# EAGLE design Auto_hub_robocon (EAGLE 8.4.3)
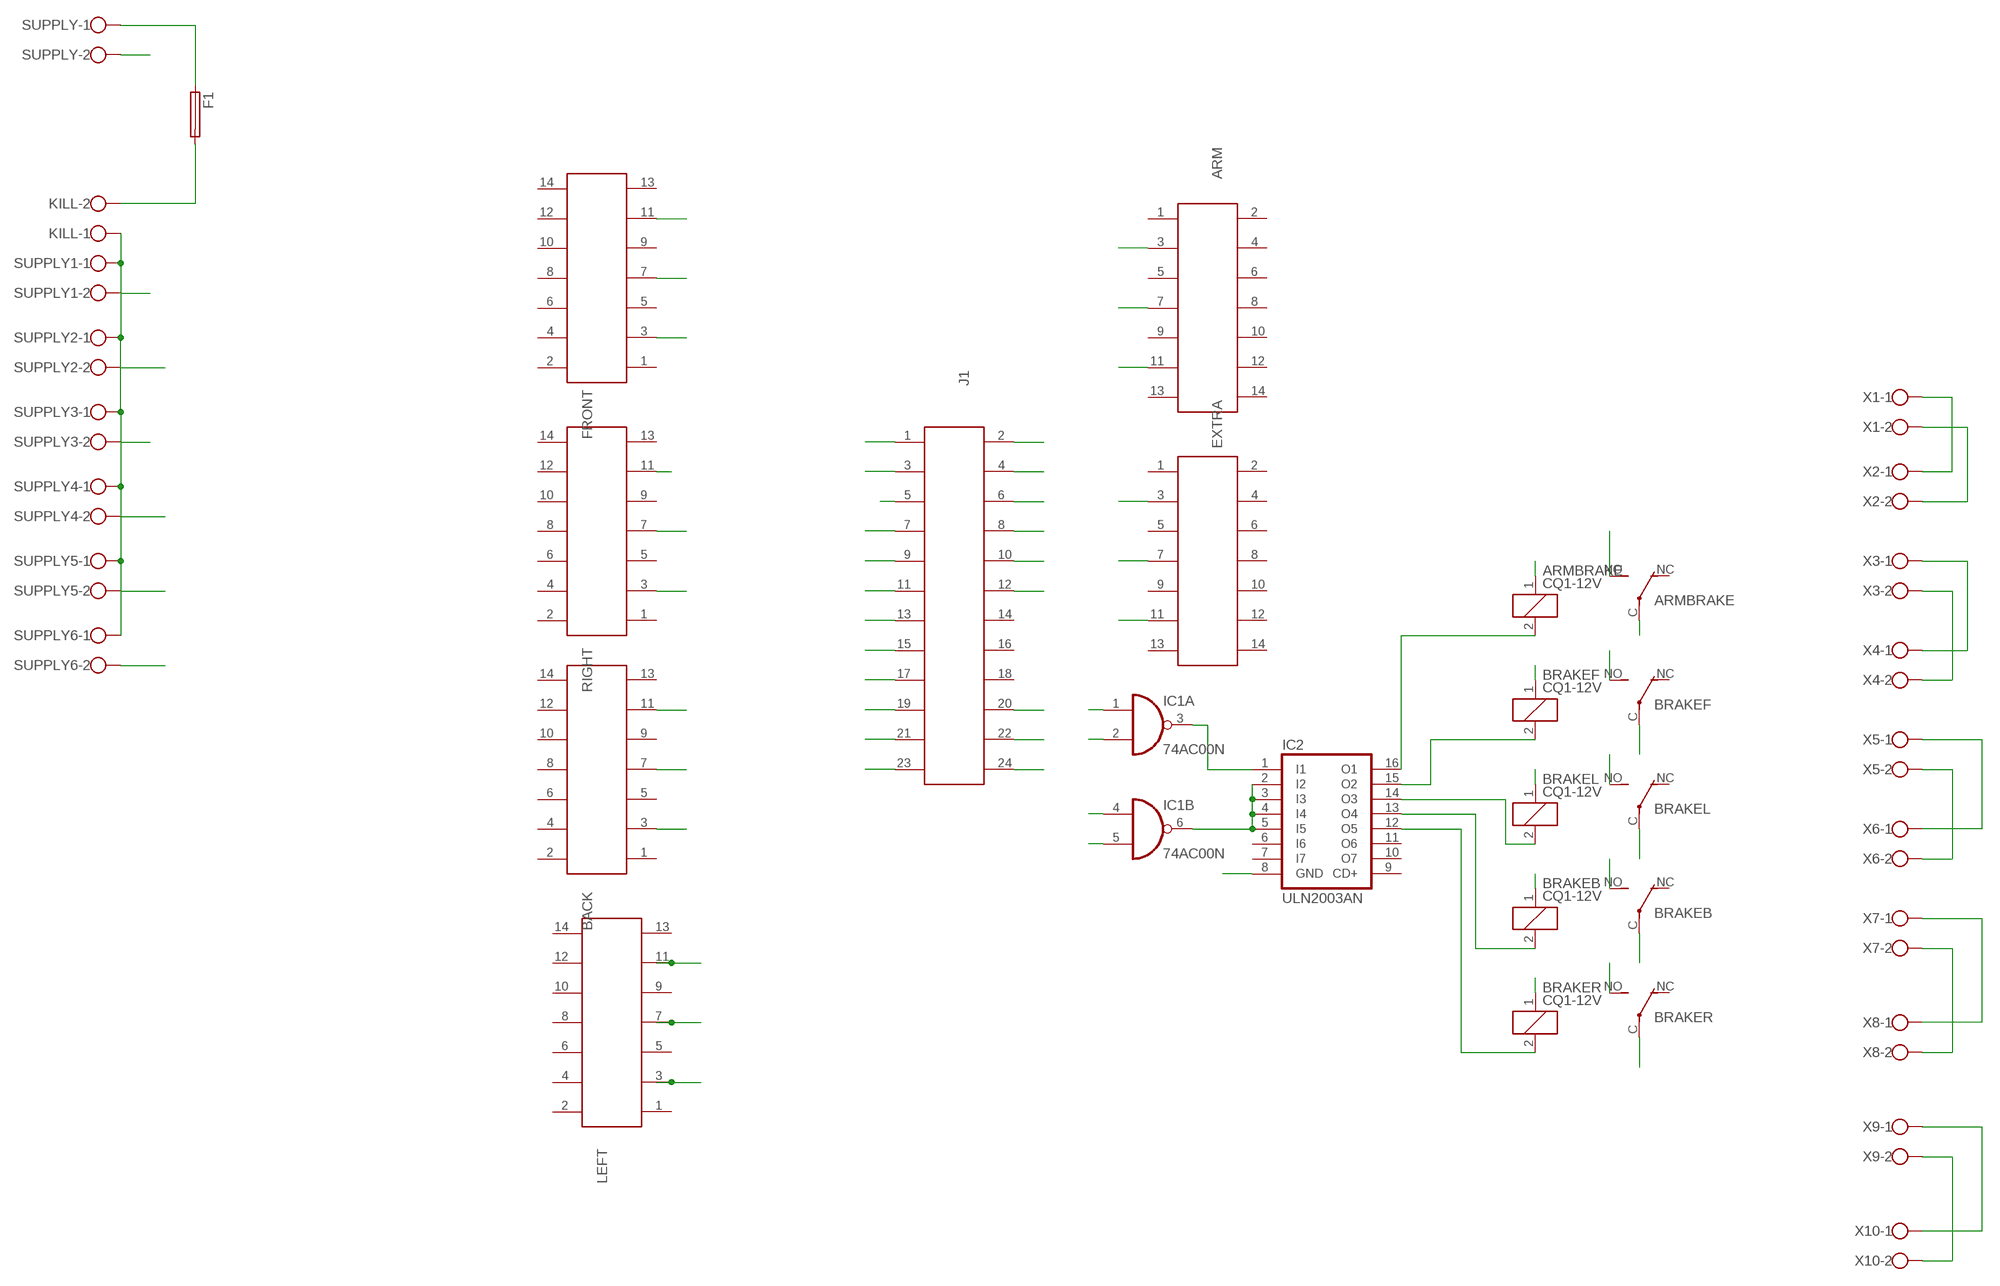
[diagram p0: schematic, sheet 1]

## Parts
ARM  61201421621  [61201421621]
ARMBRAKE  CQ1-12V  [CQ1]
BACK  61201421621  [61201421621]
BRAKEB  CQ1-12V  [CQ1]
BRAKEF  CQ1-12V  [CQ1]
BRAKEL  CQ1-12V  [CQ1]
BRAKER  CQ1-12V  [CQ1]
EXTRA  61201421621  [61201421621]
F1  GSH15  [GSH15]
FRONT  61201421621  [61201421621]
IC1  74AC00N  [DIL14]
IC2  ULN2003AN  [DIL16]
J1  61202421621  [61202421621]
KILL  W237-102  [W237-102]
LEFT  61201421621  [61201421621]
RIGHT  61201421621  [61201421621]
SUPPLY  W237-102  [W237-102]
SUPPLY1  W237-102  [W237-102]
SUPPLY2  W237-102  [W237-102]
SUPPLY3  W237-102  [W237-102]
SUPPLY4  W237-102  [W237-102]
SUPPLY5  W237-102  [W237-102]
SUPPLY6  W237-102  [W237-102]
X1  W237-102  [W237-102]
X2  W237-102  [W237-102]
X3  W237-102  [W237-102]
X4  W237-102  [W237-102]
X5  W237-102  [W237-102]
X6  W237-102  [W237-102]
X7  W237-102  [W237-102]
X8  W237-102  [W237-102]
X9  W237-102  [W237-102]
X10  W237-102  [W237-102]

## Nets
5V: ARMBRAKE.1 BRAKEB.1 BRAKEF.1 BRAKEL.1 BRAKER.1 IC1.2(A:I1) IC1.4(B:I0) J1.22
ARM1: ARMBRAKE.C(2:P) X1.1 X2.1
ARM2: ARMBRAKE.NO(2:S) X1.2 X2.2
ARMBRAKE: IC1.1(A:I0) J1.20
ARMIN1: ARM.3 J1.2
ARMIN2: ARM.11 J1.6
ARMPWM: ARM.7 J1.4
BASEBRAKE: IC1.5(B:I1) J1.24
BIN1: BACK.11 J1.13
BIN2: BACK.3 J1.17
BPWM: BACK.7 J1.15
BRAKEB1: BRAKEB.C(2:P) X7.1 X8.1
BRAKEB2: BRAKEB.NO(2:S) X7.2 X8.2
BRAKEF1: BRAKEF.C(2:P) X3.1 X4.1
BRAKEF2: BRAKEF.NO(2:S) X3.2 X4.2
BRAKEL1: BRAKEL.C(2:P) X5.1 X6.1
BRAKEL2: BRAKEL.NO(2:S) X5.2 X6.2
BRAKER1: BRAKER.C(2:P) X9.1 X10.1
BRAKER2: BRAKER.NO(2:S) X9.2 X10.2
EXTRAIN1: EXTRA.3 J1.8
EXTRAIN2: EXTRA.11 J1.12
EXTRAPWM: EXTRA.7 J1.10
FIN1: FRONT.11 J1.1
FIN2: FRONT.3 J1.5
FPWM: FRONT.7 J1.3
GND: IC2.8(GND) SUPPLY1.2 SUPPLY2.2 SUPPLY3.2 SUPPLY4.2 SUPPLY5.2 SUPPLY6.2 SUPPLY.2
LIN1: J1.19 LEFT.11
LIN2: J1.23 LEFT.3
LPWM: J1.21 LEFT.7
N$1: ARMBRAKE.2 IC2.16(O1)
N$2: BRAKEF.2 IC2.15(O2)
N$3: BRAKEL.2 IC2.14(O3)
N$4: IC1.3(A:O) IC2.1(I1)
N$5: BRAKEB.2 IC2.13(O4)
N$6: BRAKER.2 IC2.12(O5)
N$7: IC1.6(B:O) IC2.2(I2) IC2.3(I3) IC2.4(I4) IC2.5(I5)
N$8: F1.1 SUPPLY.1
N$9: F1.2 KILL.2
N$10: KILL.1 SUPPLY1.1 SUPPLY2.1 SUPPLY3.1 SUPPLY4.1 SUPPLY5.1 SUPPLY6.1
RIN1: J1.7 RIGHT.11
RIN2: J1.11 RIGHT.3
RPWM: J1.9 RIGHT.7
Unconnected: ARM.1 ARM.2 ARM.4 ARM.5 ARM.6 ARM.8 ARM.9 ARM.10 ARM.12 ARM.13 ARM.14 ARMBRAKE.NC(2:O) BACK.1 BACK.2 BACK.4 BACK.5 BACK.6 BACK.8 BACK.9 BACK.10 BACK.12 BACK.13 BACK.14 BRAKEB.NC(2:O) BRAKEF.NC(2:O) BRAKEL.NC(2:O) BRAKER.NC(2:O) EXTRA.1 EXTRA.2 EXTRA.4 EXTRA.5 EXTRA.6 EXTRA.8 EXTRA.9 EXTRA.10 EXTRA.12 EXTRA.13 EXTRA.14 FRONT.1 FRONT.2 FRONT.4 FRONT.5 FRONT.6 FRONT.8 FRONT.9 FRONT.10 FRONT.12 FRONT.13 FRONT.14 IC1.8(C:O) IC1.9(C:I0) IC1.10(C:I1) IC1.11(D:O) IC1.12(D:I0) IC1.13(D:I1) IC2.6(I6) IC2.7(I7) IC2.9(CD+) IC2.10(O7) IC2.11(O6) J1.14 J1.16 J1.18 LEFT.1 LEFT.2 LEFT.4 LEFT.5 LEFT.6 LEFT.8 LEFT.9 LEFT.10 LEFT.12 LEFT.13 LEFT.14 RIGHT.1 RIGHT.2 RIGHT.4 RIGHT.5 RIGHT.6 RIGHT.8 RIGHT.9 RIGHT.10 RIGHT.12 RIGHT.13 RIGHT.14

## Power pins joined to a net without a drawn wire
GND: IC1.7(P:GND)
VCC: IC1.14(P:VCC)

## Library data of the parts
ARM BACK EXTRA FRONT LEFT RIGHT = Wurth_Elektronik_Electromechanic_Wire_to_Board_Connectors_rev17b:61201421621: WR-BHD 2.54mm Male Box Header, 14 Pins=>Code : Con_WTB_BHD_2.54_Male_THT_WS_61201421621 <http://katalog.we-online.de/media/thumbs2/eican/thb_Con_WTB_BHD_2.54_Male_THT_WS_6120xx21621_pf2.jpg> Details see: http://katalog.we-online.de/en/em/612_0xx_216_21 Created 2014-06-04, Karrer Zheng 2014 (C) Würth Elektronik
ARMBRAKE BRAKEB BRAKEF BRAKEL BRAKER = relay:CQ1-12V: AUTOMOTIVE QUIET RELAY NAiS Source: http://www.mew-europe.com/.. en_ds_61208_0000.pdf; OC_FARNELL: unknown; OC_NEWARK: unknown
F1 = fuse:GSH15: FUSE HOLDER grid 15mm, 19649 Wickmann; MPN: 64900001039; OC_FARNELL: 1271673; OC_NEWARK: 02P0318
IC1 = 74xx-eu:74*00: Quad 2-input NAND gate
IC2 = uln-udn:ULN2003A: DRIVER ARRAY
J1 = Wurth_Elektronik_Electromechanic_Wire_to_Board_Connectors_rev17b:61202421621: WR-BHD 2.54mm Male Box Header, 24 Pins=>Code : Con_WTB_BHD_2.54_Male_THT_WS_61202421621 <http://katalog.we-online.de/media/thumbs2/eican/thb_Con_WTB_BHD_2.54_Male_THT_WS_6120xx21621_pf2.jpg> Details see: http://katalog.we-online.de/en/em/612_0xx_216_21 Created 2014-06-04, Karrer Zheng 2014 (C) Würth Elektronik
KILL SUPPLY SUPPLY1-SUPPLY6 X1-X10 = con-wago-500:W237-102: WAGO SCREW CLAMP; MPN: 237-102; OC_FARNELL: unknown; OC_NEWARK: 70K9898

## Board
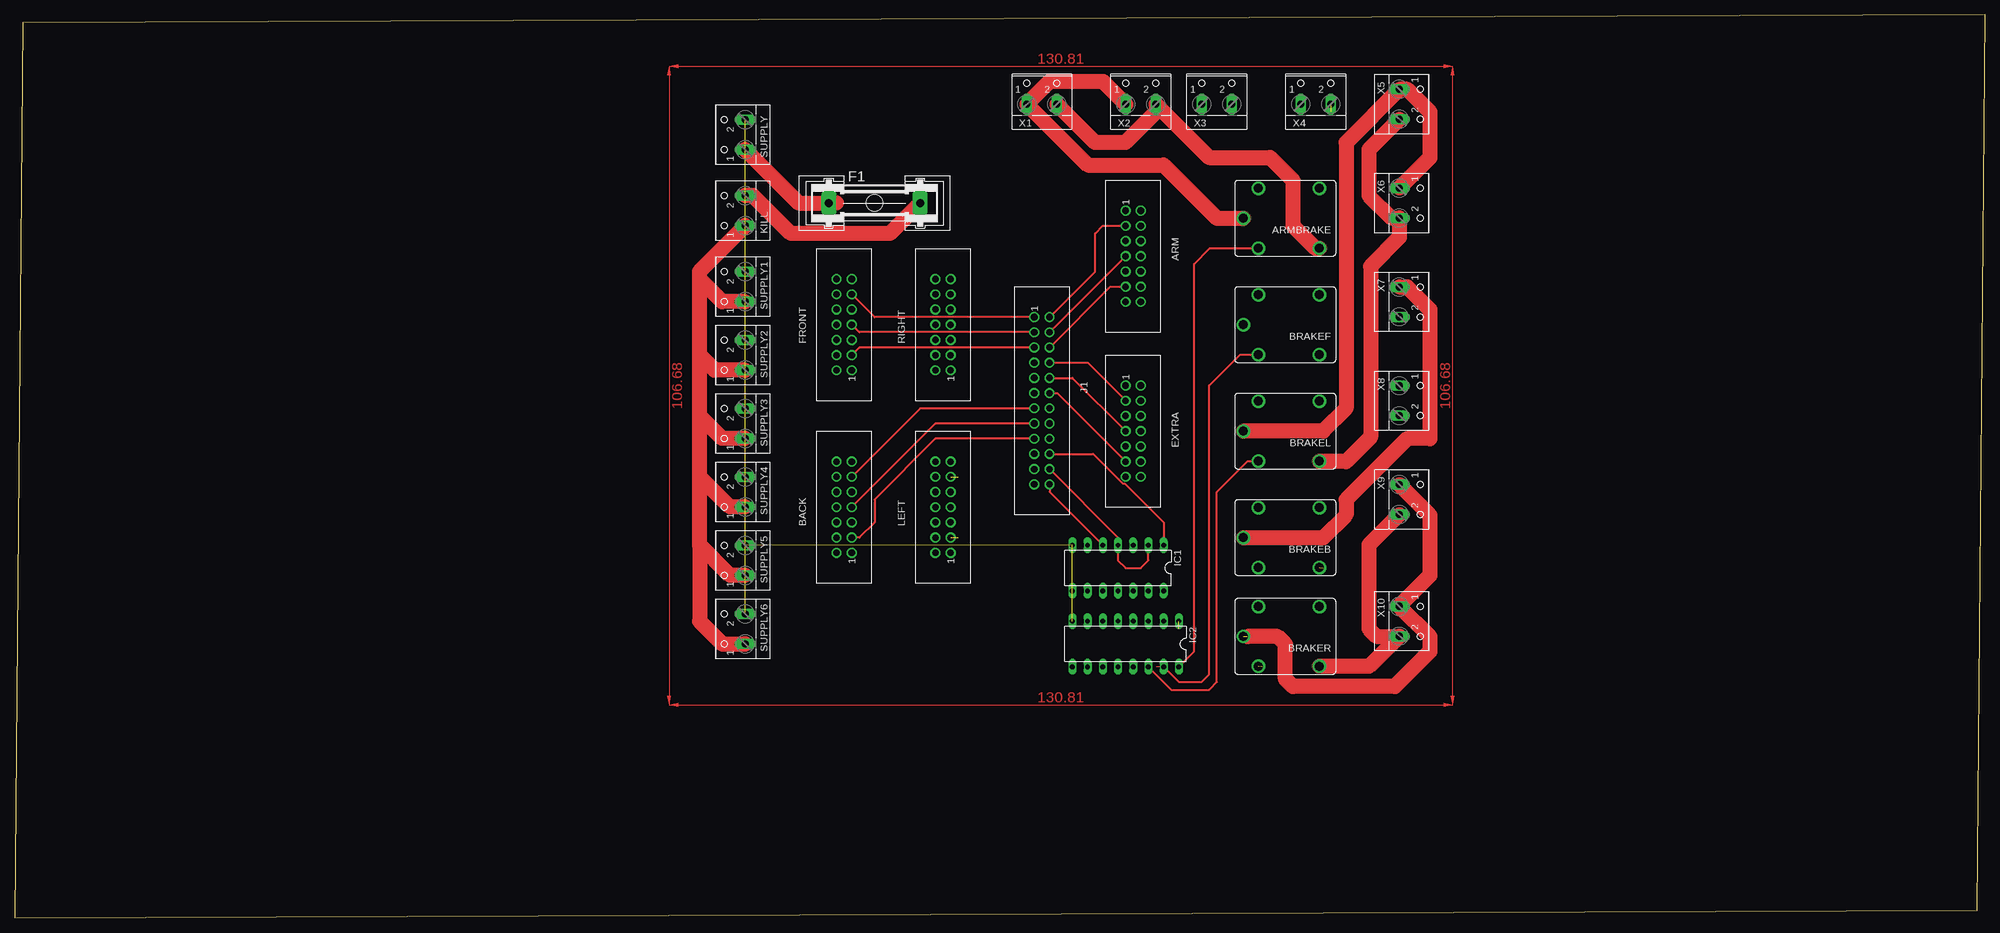
[diagram p1: board, top side]
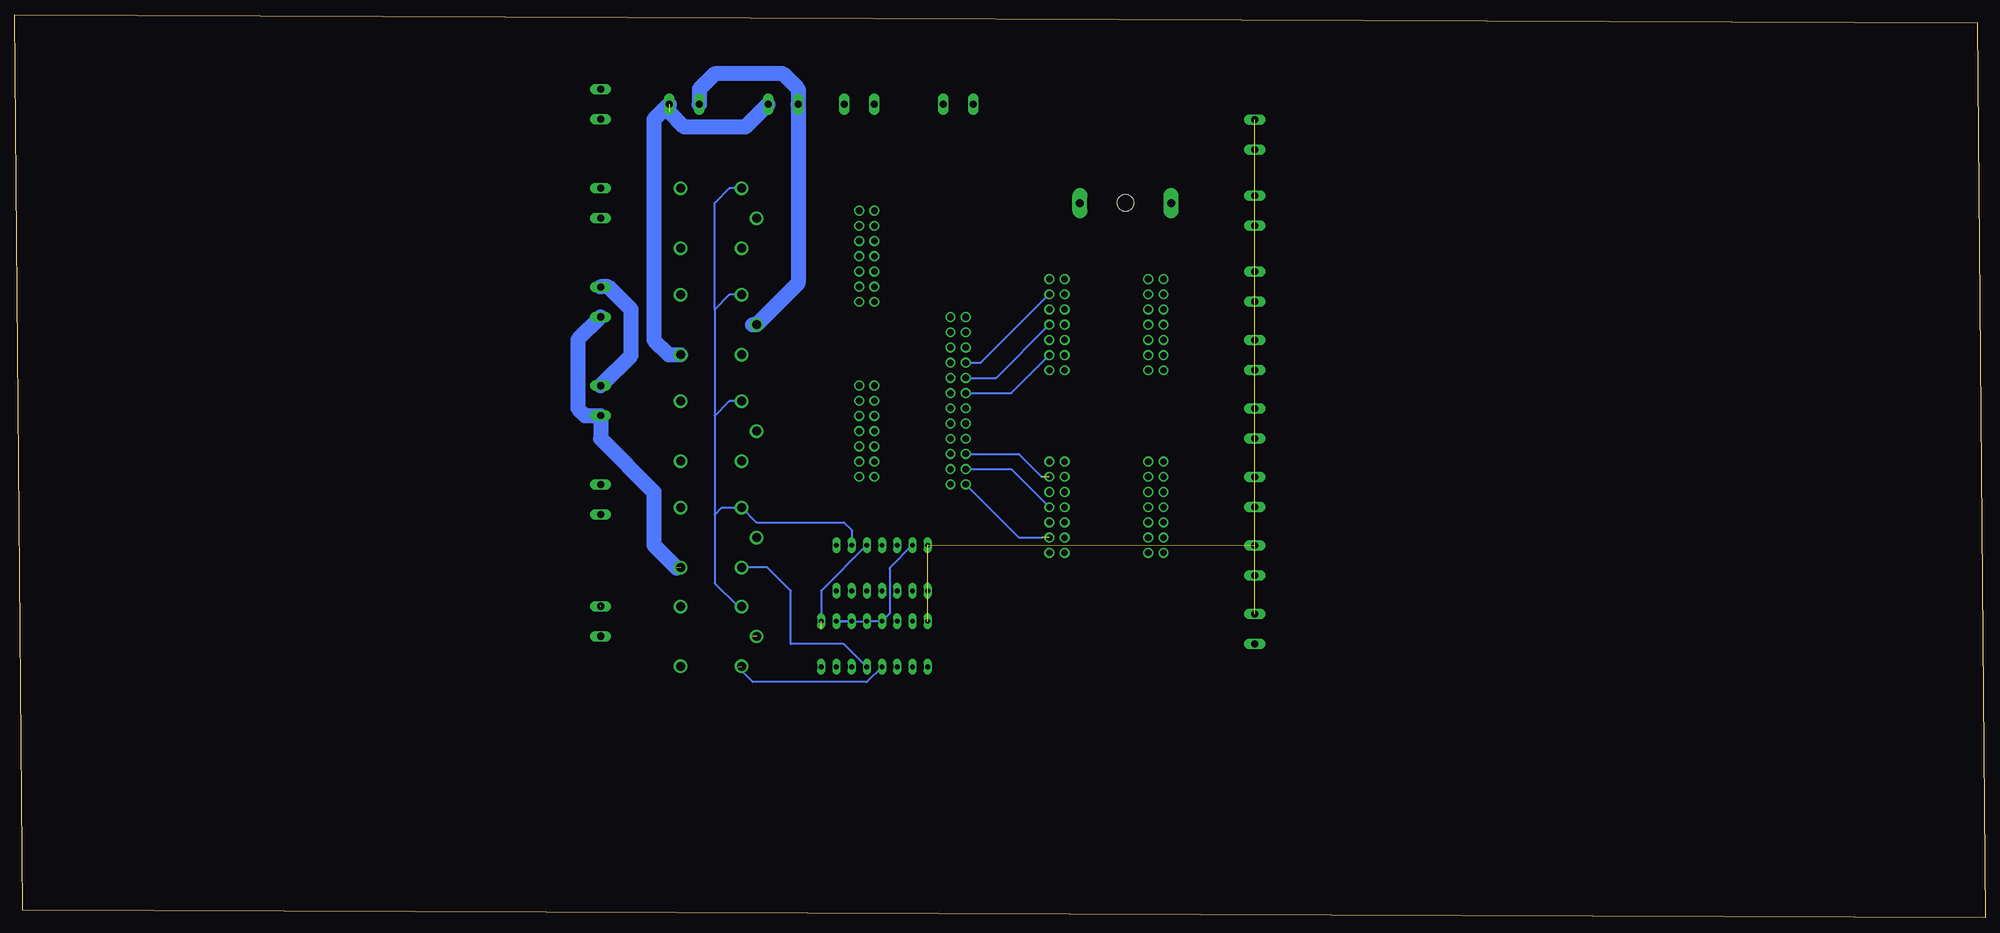
[diagram p2: board, bottom side, seen from below]

Size 328.91 x 150.8 mm. Coordinates in mm from the lower left corner, seen from the top.
Outline: 0,0 327.64,1.27 328.91,150.8 1.27,149.53 0,0
Copper layers (1*16): Top 0.035mm / dielectric 1.5mm / Bottom 0.035mm
Design rules "default": minimum track width 6mil, minimum drill 0.35mm, track to track 6mil, track to pad 6mil, pad to pad 6mil, via to via 6mil, smd to smd 6mil, copper to edge 40mil, drill to drill 6mil, minimum pad ring 10mil, minimum via ring 8mil, stop-mask expansion 4mil, vias tented up to drill 0mil, thermal gap 10mil

### Footprints (pad centres in the part's own frame; a part is rotated, then mirrored left to right if it is on the bottom)
61201421621 = drill 1.1: 1 -7.62,-1.27; 2 -7.62,1.27; 3 -5.08,-1.27; 4 -5.08,1.27; 5 -2.54,-1.27; 6 -2.54,1.27; 7 0,-1.27; 8 0,1.27; 9 2.54,-1.27; 10 2.54,1.27; 11 5.08,-1.27; 12 5.08,1.27; 13 7.62,-1.27; 14 7.62,1.27
CQ1 = drill 1.5: 1 4.5,-5; 2 4.5,5; C 7,0; NC -5.7,-5; NO -5.7,5
GSH15 = drill 1.321 pad 2.54 long: 1 -7.62,0; 2 7.62,0 | hole 2.794: 0,0
DIL14 = drill 0.813 long: 1 -7.62,-3.81; 2 -5.08,-3.81; 3 -2.54,-3.81; 4 0,-3.81; 5 2.54,-3.81; 6 5.08,-3.81; 7 7.62,-3.81; 8 7.62,3.81; 9 5.08,3.81; 10 2.54,3.81; 11 0,3.81; 12 -2.54,3.81; 13 -5.08,3.81; 14 -7.62,3.81
DIL16 = drill 0.813 long: 1 -8.89,-3.81; 2 -6.35,-3.81; 3 -3.81,-3.81; 4 -1.27,-3.81; 5 1.27,-3.81; 6 3.81,-3.81; 7 6.35,-3.81; 8 8.89,-3.81; 9 8.89,3.81; 10 6.35,3.81; 11 3.81,3.81; 12 1.27,3.81; 13 -1.27,3.81; 14 -3.81,3.81; 15 -6.35,3.81; 16 -8.89,3.81
61202421621 = drill 1.1: 1 -13.97,-1.27; 2 -13.97,1.27; 3 -11.43,-1.27; 4 -11.43,1.27; 5 -8.89,-1.27; 6 -8.89,1.27; 7 -6.35,-1.27; 8 -6.35,1.27; 9 -3.81,-1.27; 10 -3.81,1.27; 11 -1.27,-1.27; 12 -1.27,1.27; 13 1.27,-1.27; 14 1.27,1.27; 15 3.81,-1.27; 16 3.81,1.27; 17 6.35,-1.27; 18 6.35,1.27; 19 8.89,-1.27; 20 8.89,1.27; 21 11.43,-1.27; 22 11.43,1.27; 23 13.97,-1.27; 24 13.97,1.27
W237-102 = drill 1.194 long: 1 -2.5,-1.27; 2 2.5,-1.27

### Placement (x,y rotation side)
ARM  186.69,110.49 270 top
ARMBRAKE  212.09,116.84 180 top
BACK  138.43,68.58 90 top
BRAKEB  212.09,63.5 180 top
BRAKEF  212.09,99.06 180 top
BRAKEL  212.09,81.28 180 top
BRAKER  212.09,46.99 180 top
EXTRA  186.69,81.28 270 top
F1  143.51,119.38 0 top
FRONT  138.43,99.06 90 top
IC1  184.15,58.42 180 top
IC2  185.42,45.72 180 top
J1  171.45,86.36 270 top
KILL  120.65,118.11 90 top
LEFT  154.94,68.58 90 top
RIGHT  154.94,99.06 90 top
SUPPLY  120.65,130.81 90 top
SUPPLY1  120.65,105.41 90 top
SUPPLY2  120.65,93.98 90 top
SUPPLY3  120.65,82.55 90 top
SUPPLY4  120.65,71.12 90 top
SUPPLY5  120.65,59.69 90 top
SUPPLY6  120.65,48.26 90 top
X1  171.45,137.16 0 top
X2  187.96,137.16 0 top
X3  200.66,137.16 0 top
X4  217.17,137.16 0 top
X5  232.41,135.89 270 top
X6  232.41,119.38 270 top
X7  232.41,102.87 270 top
X8  232.41,86.36 270 top
X9  232.41,69.85 270 top
X10  232.41,49.53 270 top

### Tracks (layer width: path | path; a pad name or v marks a point on that pad's centre or on a via)
5V
  Top 0.305: J1.22 184.15,63.5 IC1.4 184.15,59.69 185.42,58.42 187.96,58.42 189.23,59.69 IC1.2
  Bottom 0.305: ARMBRAKE.1 209.63,121.84 212.09,119.38 212.09,101.6 | 212.09,83.82 212.09,67.31 | 212.09,101.6 212.09,83.82 | 212.09,67.31 212.09,55.88 208.28,52.07 207.67,52.07 BRAKER.1 | 212.09,67.31 210.9,68.5 BRAKEB.1 205.13,66.04 190.5,66.04 189.23,64.77 IC1.2 | BRAKEL.1 209.63,86.28 212.09,83.82 | BRAKEF.1 209.63,104.06 212.09,101.6
ARM1
  Top 2.54: X2.1 185.42,135.89 181.61,139.7 172.76,139.7 X1.1 179.11,125.73 191.77,125.73 200.66,116.84 ARMBRAKE.C
ARM2
  Top 2.54: X1.2 180.3,129.54 185.42,129.54 190.5,134.62 190.5,135.85 | 190.5,135.85 190.5,135.89 | 190.5,135.85 X2.2 199.35,127 209.55,127 213.36,123.19 213.36,115.57 217.09,111.84 ARMBRAKE.NO
ARMBRAKE
  Top 0.305: J1.20 180.01,77.47 184.95,72.53 185.28,72.53 191.77,66.04 IC1.1
ARMIN1
  Top 0.305: J1.2 180.34,107.95 180.34,114.3 181.61,115.57 ARM.3
ARMIN2
  Top 0.305: J1.6 182.88,105.41 ARM.11
ARMPWM
  Top 0.305: J1.4 ARM.7
BASEBRAKE
  Top 0.305: J1.24 172.72,71.12 IC1.5
BIN1
  Top 0.305: J1.13 151.13,85.09 BACK.11
BIN2
  Top 0.305: J1.17 153.67,80.01 143.51,69.85 143.51,66.04 140.97,63.5 BACK.3
BPWM
  Top 0.305: J1.15 153.67,82.55 BACK.7
BRAKEB1
  Top 2.54: X7.1 232.45,105.37 236.22,101.6 236.22,80.01 232.41,80.01 222.25,69.85 222.25,67.31 218.44,63.5 BRAKEB.C
  Bottom 2.54: X8.1 226.06,93.94 226.06,101.6 229.87,105.41 231.1,105.41 X7.1
BRAKEB2  (1 unrouted)
  Bottom 2.54: X7.2 234.95,96.56 234.95,85.09 233.72,83.86 X8.2 231.14,80.01 222.25,71.12 222.25,62.23 218.44,58.42
BRAKEF1
  Bottom 2.54: X4.1 214.63,135.89 214.63,138.43 212.09,140.97 200.66,140.97 198.16,138.47 X3.1 198.16,105.99 BRAKEF.C 205.74,99.06
BRAKEF2  (1 unrouted)
  Bottom 2.54: X3.2 206.97,132.08 217.17,132.08 219.71,134.62 | X4.2 222.25,133.31 222.25,96.52 219.79,94.06 BRAKEF.NO
BRAKEL1
  Top 2.54: X6.1 236.22,126.96 236.22,134.62 232.45,138.39 X5.1 222.25,129.5 222.25,85.09 218.44,81.28 BRAKEL.C
BRAKEL2
  Top 2.54: X5.2 226.06,128.31 226.06,120.65 229.83,116.88 X6.2 231.14,113.67 226.31,108.84 226.31,80.26 222.25,76.2 217.87,76.2 BRAKEL.NO
BRAKER1  (2 unrouted)
  Top 2.54: X9.1 236.22,67.27 236.22,57.15 231.14,52.07 | X10.1 236.22,46.95 236.22,44.45 230.38,38.61 213.36,38.61 212.09,39.88 212.09,45.72 210.82,46.99 205.74,46.99
BRAKER2
  Top 2.54: X9.2 226.06,62.27 | 226.06,62.27 226.06,62.23 | 226.06,62.27 226.06,48.26 227.29,47.03 X10.2 226.1,41.99 BRAKER.NO
EXTRAIN1
  Top 0.305: J1.8 179.07,92.71 EXTRA.3
EXTRAIN2
  Top 0.305: J1.12 173.99,87.63 EXTRA.11
EXTRAPWM
  Top 0.305: J1.10 176.53,90.17 EXTRA.7
FIN1
  Top 0.305: J1.1 143.51,100.33 FRONT.11
FIN2
  Top 0.305: J1.5 140.97,95.25 FRONT.3
FPWM
  Top 0.305: J1.3 140.97,97.79 FRONT.7
GND  (8 unrouted)
LIN1  (1 unrouted)
  Bottom 0.305: J1.19 161.29,77.47 157.48,73.66
LIN2  (1 unrouted)
  Bottom 0.305: J1.23 161.29,63.5 157.48,63.5
LPWM
  Bottom 0.305: J1.21 162.56,74.93 LEFT.7
N$1
  Top 0.305: IC2.16 196.85,44.45 196.85,109.22 199.47,111.84 ARMBRAKE.2
N$2
  Top 0.152: IC2.15 190.5,41.91
  Top 0.305: IC2.15 194.31,39.37 198.12,39.37 199.39,40.64 199.39,88.9 204.55,94.06 BRAKEF.2
N$3
  Top 0.305: IC2.14 193.04,38.1 199.39,38.1 200.66,39.37 200.66,71.12 205.82,76.28 BRAKEL.2
N$4  (1 unrouted)
  Bottom 0.305: IC1.3 194.31,54.61 194.31,48.26
N$5
  Bottom 0.305: IC2.13 190.5,45.72 199.39,45.72 199.39,54.61 203.28,58.5 BRAKEB.2
N$6  (1 unrouted)
  Bottom 0.305: IC2.12 186.69,39.37 205.74,39.37 208.28,41.91
N$7
  Bottom 0.305: IC1.6 182.88,58.42 182.88,50.8 IC2.5 IC2.4 IC2.2 IC2.3
N$8
  Top 2.54: SUPPLY.1 130.85,119.38 F1.1 | F1.1 137.16,119.38 F1.1
N$9  (1 unrouted)
  Top 2.54: F1.2 146.05,114.3 129.54,114.3 123.19,120.65 121.92,120.65
N$10
  Top 2.54: KILL.1 114.3,107.99 114.3,106.68 | SUPPLY6.1 121.88,45.72 118.11,45.72 114.3,49.53 114.3,62.23 | 114.3,93.98 114.3,106.68 | 114.3,83.82 114.3,93.98 | 114.3,73.66 114.3,83.82 | 114.3,62.23 114.3,73.66 | SUPPLY1.1 118.07,102.91 114.3,106.68 | SUPPLY2.1 116.8,91.48 114.3,93.98 | SUPPLY3.1 118.07,80.05 114.3,83.82 | SUPPLY4.1 119.34,68.62 114.3,73.66 | SUPPLY5.1 119.34,57.19 114.3,62.23
RIN1
  Bottom 0.305: J1.7 167.64,92.71 RIGHT.11
RIN2
  Bottom 0.305: J1.11 162.56,87.63 RIGHT.3
RPWM
  Bottom 0.305: J1.9 165.1,90.17 RIGHT.7
(copper drawn outside any net)
  shapes: Top area x4